# Altium schematic sheet powerSupply.SchDoc
size A
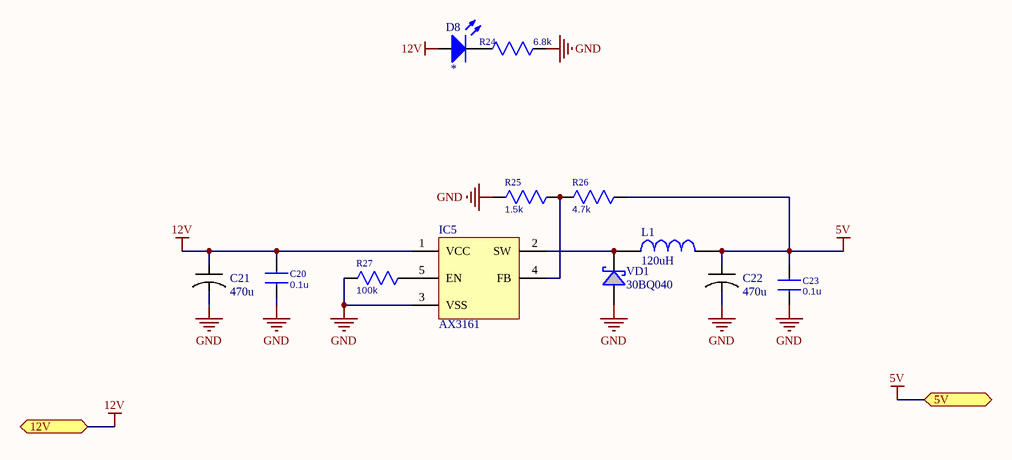
[diagram p0: powerSupply.SchDoc]

## Parts
C20  0.1u  [C_0603]
C21  470u  [ELV471M25RF]
C22  470u  [ELV471M25RF]
C23  0.1u  [C_0603]
D8  *  [LED_5mm]
IC5  AX3161  [TO263-5L]
L1  120uH  [L-12.3x12.3]
R24  6.8k  [R_0603]
R25  1.5k  [R_0603]
R26  4.7k  [R_0603]
R27  100k  [R_0603]
VD1  30BQ040  [DO-214AB (SMC)]

## Ports
5V, 12V

## Nets
5V: C22.1 C23.2 L1.2 R26.1 ; port 5V
12V: C20.2 C21.1 D8.1(A) IC5.1(VCC) ; port 12V
GND: C20.1 C21.2 C22.2 C23.1 IC5.3(VSS) R24.2 R25.2 R27.2 VD1.A
NetD8_2: D8.2(K) R24.1
NetIC5_2: IC5.2(SW) L1.1 VD1.C
NetIC5_4: IC5.4(FB) R25.1 R26.2
NetIC5_5: IC5.5(EN) R27.1

## Library data of the parts
C20 C23 = C0603: Capacitor; Value: 0.1u
C21 C22 = Electrolit: Electrolit capasitor; Value: 470u
D8 = LED_5mm: Typical INFRARED GaAs LED; Value: *; Color: *
IC5 = AX3161: 52KHz, 2A PWM Buck DC/DC Converter; Link: https://voron.ua/catalog/031858
L1 = L: Inductor; Value: 120uH
R24-R27 = R0603: Resistor
  R24: Value: 6.8k
  R25: Value: 1.5k
  R26: Value: 4.7k
  R27: Value: 100k
VD1 = 30BQ040: High Performance Schottky Rectifier, 3.0 A; Link: https://voron.ua/catalog/schottky-diode-30bq040-irf